# Altium schematic sheet 02-Power.SchDoc: ECE315 Power and Programming
size A; Date: 01/08/2018; ApprovedBy: JSK; CheckedBy: JSK; Author: JSK; CompanyName: University of Wisconsin; DrawnBy: JSK; Engineer: JSK; Organization: ECE 315; Address1: College of Engineering; Address2: 1415 Engineering Drive; Address3: Madison, WI 53706; Address4: ECE 315 Spring 2018; Revision: A; SheetNumber: 2; SheetTotal: 6; AssemblyNumber: ECE315-S18; ApprovedDate: 4/25/2017
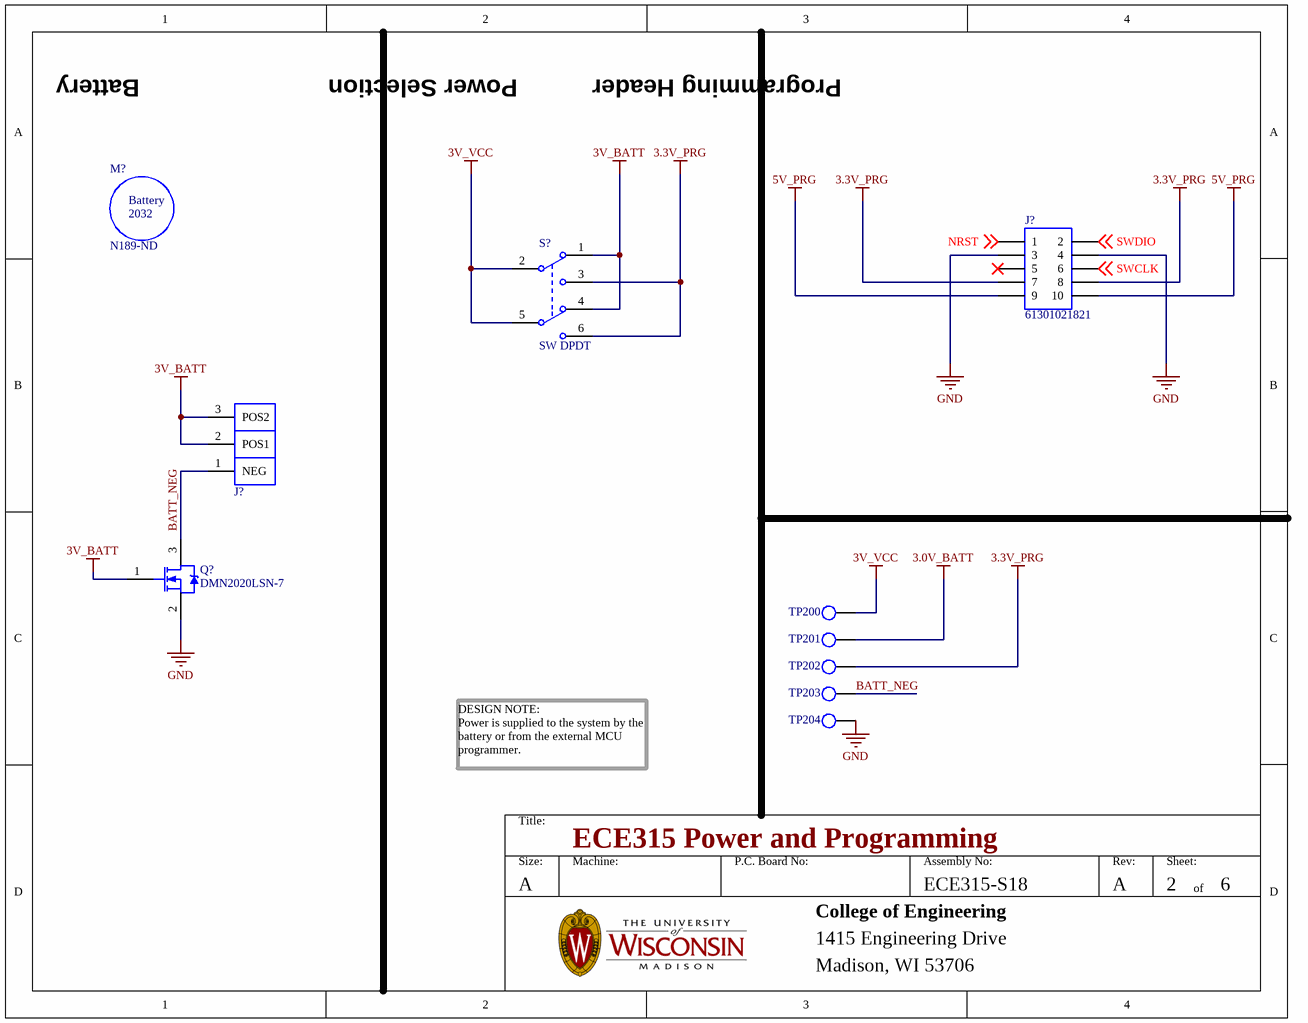
[diagram p0: 02-Power.SchDoc]

## Parts
(Parts that share a designator on the sheet are numbered #1, #2 ... from top to bottom, then left to right.)
J?#1  Manufacturer Part Number: 61301021821  [CONN_ST_PROGRAMMER]  (hidden comment: CONN_ST_PROGRAMMER)
J?#2  CONN_BAT_2032  [BATT_2032]  (value not drawn)
M?  Supplier Part Number 1: N189-ND  (hidden comment: BATTERY_2032)
Q?  Manufacturer Part Number: DMN2020LSN-7  [SOT23]  (hidden comment: IC_NMOS_DMN2020LSN)
S?  SW DPDT  [DPDT]
TP200  TP_1206  [TP-SMC-1206]  (value not drawn)
TP201  TP_1206  [TP-SMC-1206]  (value not drawn)
TP202  TP_1206  [TP-SMC-1206]  (value not drawn)
TP203  TP_1206  [TP-SMC-1206]  (value not drawn)
TP204  TP_1206  [TP-SMC-1206]  (value not drawn)

## Nets
3.0V_BATT: TP201.1
3.3V_PRG: J?#1.7 J?#1.8 S?.3(NO1) S?.6(NO2) TP202.1
3V_BATT: J?#2.2(POS1) J?#2.3(POS2) Q?.1 S?.1(NC1) S?.4(NC2)
3V_VCC: S?.2(COMMON1) S?.5(COMMON2) TP200.1
5V_PRG: J?#1.9 J?#1.10
GND: J?#1.3 J?#1.4 Q?.2 TP204.1
BATT_NEG: J?#2.1(NEG) Q?.3 TP203.1
NRST: J?#1.1 ; off-sheet NRST
SWCLK: J?#1.6 ; off-sheet SWCLK
SWDIO: J?#1.2 ; off-sheet SWDIO

Not connected (* = marked no-connect by the designer): J?#1 5*

## Notes on the sheet
- Battery
- Power Selection
- Programming Header
- DESIGN NOTE:
  Power is supplied to the system by the battery or from the external MCU programmer.
- Title:
- Size:
- A
- Machine:
- P.C. Board No:
- Assembly No:
- Rev:
- Sheet:
- of
- College of Engineering
- 1415 Engineering Drive
- Madison, WI 53706
- (in symbol BATTERY_2032) Battery; 2032

## Library data of the parts
J?#1 = CONN_ST_PROGRAMMER: CONN HEADER 2.54MM 10POS GOLD; Manufacturer: Wurth Electronics Inc.; Style: Board to Board; Number of Positions: 10; Number of Positions Loaded: All; Pitch - Mating: 0.100" (2.54mm); Contact Length - Post: 0.122" (3.10mm); Material Flammability Rating: UL94 V-0; Current Rating: 3A; Voltage Rating: 250VAC; Supplier 1: Digi-Key; RoHS: RoHS Compliant; Category: Connectors, Interconnects; Stock 1: 4086; Pricing 1: 1=0.74, 10=0.728, 50=0.672, 100=0.616, 320=0.56 (USD); Packaging: Tray; Part Status: Active; Connector Type: Header; Contact Type: Forked; Row Spacing - Mating: 0.100" (2.54mm); Mounting Type: Through Hole; Termination: Solder; Fastening Type: Push-Pull; Contact Finish - Mating: Gold; Contact Finish Thickness - Mating: -; Insulation Color: Black; Insulation Height: 0.331" (8.40mm); Operating Temperature: -40°C ~ 105°C; Contact Finish - Post: Gold; Mated Stacking Heights: -; Ingress Protection: -; Features: -; Applications: -; Insulation Material: Polybutylene Terephthalate (PBT); Contact Shape: Square; Contact Material: Copper Alloy; Contact Finish Thickness - Post: -; ComponentLink1URL: http://katalog.we-online.de/em/datasheet/6130xx21821.pdf; ComponentLink1Description: http://katalog.we-online.de/em/datasheet/6130xx21821.pdf; Supplier Part Number 1: 732-2861-ND
J?#2 = CONN_BAT_2032: HOLDER BATTERY 20MM COIN; Manufacturer: Linx; Manufacturer Part Number: BAT-HLD-001; Brand: Linx Technologies; Number of Batteries: 1 Battery; Number of Contacts: 1 Contact; Supplier 1: Digikey; Stock 1: 950; Pricing 1: 1=0.28, 25=0.2572, 100=0.233, 1000=0.2196 (USD); Product Category: Coin Cell Battery Holders; RoHS: Details; Product: Battery Holders; Battery Cell Size: 20 mm; Termination Style: SMD/SMT; Packaging: Bulk; Factory Pack Quantity: 1000; Type: 20 mm Battery Holder; ComponentLink1URL: https://datasheet.ciiva.com/4/bat-hld-001-4035.pdf; ComponentLink1Description: https://datasheet.ciiva.com/4/bat-hld-001-4035.pdf; ComponentLink2URL: https://datasheet.ciiva.com/4642/bat-hld-001-220194-4642567.pdf; ComponentLink2Description: https://datasheet.ciiva.com/4642/bat-hld-001-220194-4642567.pdf; ComponentLink3URL: https://datasheet.ciiva.com/16207/bat-hld-001-16207212.pdf; ComponentLink3Description: https://datasheet.ciiva.com/16207/bat-hld-001-16207212.pdf; Supplier Part Number 1: BAT-HLD-001-ND
M? = BATTERY_2032: Manufacturer: Energizer; Manufacturer Part Number: CR2032VP; MSDS Material Safety Datasheet: Lithium Manganese Dioxide(Coin/Button) PSDS; Battery Chemistry: Lithium; Battery Cell Size: Coin, 20.0mm; Voltage - Rated: 3V; Capacity: 240mAh; Discharge Rate: 190µA; Shipping Info: Due to possible restrictions, a change in ship method may be required.; Dynamic Catalog: CR (Coin) Series; For Use With: N533-ND / - CAP LIGHT 3-LED LITHIUM COIN; Associated Product: 952-1737-6-ND / - HOLDER BATT COIN CR2032/20MM / 952-1737-1-ND / - HOLDER BATT COIN CR2032/20MM / 952-1735-6-ND / - HOLDER BATT COIN CR2032/20MM / 952-1735-1-ND / - HOLDER BATT COIN CR2032/20MM / 952-1737-2-ND / - HOLDER BATT COIN CR2032/20MM / 952-1743-ND / - HOLDER BATT COIN CR2032/20MM / 952-1735-2-ND / - HOLDER BATT COIN CR2032/20MM / BH-20H-1TCT-ND / - HOLDER BATT COIN CELL 2032 SMD / 3082TRK-ND / - RETAINER COIN CELL 20MM SMD / 3072TRK-ND / - RETAINER COIN CELL 20MM SMD / More...; Other Names: 547-189 / 547-189-ND / N189; Supplier 1: Digikey; Stock 1: 563743; Pricing 1: 1=0.34, 10=0.31, 50=0.2758, 100=0.2414, 250=0.2207, 500=0.2069, 1000=0.1841, 2500=0.1729 (USD); Standard Package: 200; Category: Battery Products; Family: Batteries Non-Rechargeable (Primary); Series: CR2032; Size / Dimension: 0.79" Dia x 0.13" H (20.0mm x 3.2mm); Termination Style: Requires Holder; Weight: 0.1 oz (2.85g); ComponentLink1URL: https://datasheet.ciiva.com/6572/cr2032-6572607.pdf; ComponentLink1Description: https://datasheet.ciiva.com/6572/cr2032-6572607.pdf
Q? = IC_NMOS_DMN2020LSN: Manufacturer: Diodes; Rise Time: 12.49ns; Continuous Drain Current (ID): 6.9A; Gate to Source Voltage (Vgs): 12V; Turn-Off Delay Time: 35.89ns; Turn-On Delay Time: 11.67ns; Fall Time: 12.33ns; Input Capacitance: 1.149nF; Number of Elements: 1; Max Power Dissipation: 610mW; Rds On Max: 20mR; Drain to Source Resistance: 13mR; Drain to Source Voltage (Vdss): 20V; Threshold Voltage: 1V; Element Configuration: Single; Supplier 1: Digikey; Stock 1: 13099; Pricing 1: 1=0.52, 10=0.418, 100=0.2843, 500=0.2132, 1000=0.1599 (USD); Mount: Surface Mount; Case/Package: SC; Number of Pins: 3; Weight: 0.000282oz; Min Operating Temperature: -55°C; Max Operating Temperature: 150°C; Packaging: Tape and Reel; Package Quantity: 3000; Power Dissipation: 610mW; Number of Channels: 1; Length: 3.1mm; Height: 1.3mm; Width: 1.7mm; REACH SVHC: No SVHC; Lead Free: Lead Free; ComponentLink1URL: https://datasheet.ciiva.com/934/ds31946-934870.pdf; ComponentLink1Description: https://datasheet.ciiva.com/934/ds31946-934870.pdf; ComponentLink2URL: https://datasheet.ciiva.com/25625/0900766b8104e58b-25625153.pdf; ComponentLink2Description: https://datasheet.ciiva.com/25625/0900766b8104e58b-25625153.pdf; ComponentLink3URL: https://datasheet.ciiva.com/4444/ds31946-65244-4444482.pdf; ComponentLink3Description: https://datasheet.ciiva.com/4444/ds31946-65244-4444482.pdf; ComponentLink4URL: https://datasheet.ciiva.com/934/ds31946-934871.pdf; ComponentLink4Description: https://datasheet.ciiva.com/934/ds31946-934871.pdf; ComponentLink5URL: https://datasheet.ciiva.com/934/ds31946-934872.pdf; ComponentLink5Description: https://datasheet.ciiva.com/934/ds31946-934872.pdf; Supplier Part Number 1: DMN2020LSN-7DICT-ND
S? = SW DPDT: Switch; Manufacturer: ITT /  C&K Components; Manufacturer Part Number: JS202011SCQN; Actuator Color: Black; Maximum DC Voltage Rating: 6 V; Actuator Material: Nylon 4/6; Electrical Life: 15000 Cycles; Body Orientation: Straight; Maximum Contact Resistance: 70 mOhm; Actuator Style: Top Slide; Dielectric Strength: 500 VAC; Minimum Insulation Resistance: 100 MOhm; Contact Rating @ Voltage: 0.3@6VDC A; COO: US; Published: 24-Mar-1999; LatestRevisionDate: 29-May-2009; LatestRevisionNote: IPC-7351 Footprint Added.; PackageVersion: Mar-2001; PackageReference: SOT23-6; Publisher: Altium Limited; PackageDescription: 6-Pin SOT-23 Package 0.95 mm Pitch, 2.7 mm Lead Span; Code_JEITA: SC-74; Code_IPC: SOT26A-6; Supplier 1: C&K Components; Stock 1: 22661; Pricing 1: 1=0.46, 10=0.441, 25=0.4316, 50=0.3858, 100=0.3674, 250=0.3582, 500=0.3031 (USD); Part No: JS202011SCQN; RoHS: Yes; Supplier Standard Pack: 5,000; Type: Sub-Miniature; Maximum AC Voltage Rating: N/A; Family: JS; Contact Material: Copper Alloy; Seal Description: N/A; Pole Throw Configuration: DPDT; Mechanical Life: N/A; Packaging: Tape and Reel; Contact Plating: Silver; Switch Configuration: N/A; Housing Material: Nylon 4/6; Product Weight: N/A; Base Material: N/A; Mounting: Surface Mount,Gull Wing; Seal Location: N/A; Operating Temperature: -40 to 85 C; Dimension: 9 x 7.5 x 5.5 mm; HTS: 8536509050; ECCN: EAR99; ComponentLink1URL: https://datasheet.ciiva.com/23829/1707718-23829488.pdf; ComponentLink1Description: https://datasheet.ciiva.com/23829/1707718-23829488.pdf; ComponentLink2URL: https://datasheet.ciiva.com/2889/js-29aug13-2889127.pdf; ComponentLink2Description: https://datasheet.ciiva.com/2889/js-29aug13-2889127.pdf; ComponentLink3URL: https://datasheet.ciiva.com/2889/js-15sept15-2889128.pdf; ComponentLink3Description: https://datasheet.ciiva.com/2889/js-15sept15-2889128.pdf; ComponentLink4URL: https://datasheet.ciiva.com/2889/js-15sept15-2889129.pdf; ComponentLink4Description: https://datasheet.ciiva.com/2889/js-15sept15-2889129.pdf; ComponentLink5URL: https://datasheet.ciiva.com/22630/1707718-22630697.pdf; ComponentLink5Description: https://datasheet.ciiva.com/22630/1707718-22630697.pdf; ComponentLink6URL: https://datasheet.ciiva.com/8625/js-9dec14-8625470.pdf; ComponentLink6Description: https://datasheet.ciiva.com/8625/js-9dec14-8625470.pdf; Supplier Part Number 1: 401-2002-1-ND
TP200-TP204 = TP_1206: Test Point SMD 1206; Manufacturer: TE Connectivity (Tyco Electronics); Manufacturer Part Number: 1625854-1; Resistance Value: 0 Ohm; Temperature Coefficient: N/R; Supplier 1: Digi-Key; Supplier Part Number 1: A106143CT-ND; Stock 1: 31937; Pricing 1: 1=0.28, 10=0.261, 25=0.224, 50=0.1902, 100=0.1828, 250=0.1641, 500=0.1567, 1000=0.1306 (USD); Case Size: 1206; Dimension: 3.2 x 1.6 x 1.25mm; Family: RC; Mounting: Surface Mount; Operating Temperature: -55 to 125 C; Part No: 1625854-1; RoHS: Yes; Packaging: Tape and Reel; Termination Style: N/R; Terminal Pitch: N/R; Power Rating: N/R; Tolerance: N/R; ComponentLink1URL: https://datasheet.ciiva.com/6439/eng-ds-1773266-a-6439169.pdf; ComponentLink1Description: https://datasheet.ciiva.com/6439/eng-ds-1773266-a-6439169.pdf; ComponentLink2URL: https://datasheet.ciiva.com/30136/1773266-a-30136341.pdf; ComponentLink2Description: https://datasheet.ciiva.com/30136/1773266-a-30136341.pdf; ComponentLink3URL: https://datasheet.ciiva.com/6439/eng-ds-1773266-a-6439080.pdf; ComponentLink3Description: https://datasheet.ciiva.com/6439/eng-ds-1773266-a-6439080.pdf; ComponentLink4URL: https://datasheet.ciiva.com/6439/eng-ds-1773266-a-6439081.pdf; ComponentLink4Description: https://datasheet.ciiva.com/6439/eng-ds-1773266-a-6439081.pdf; ComponentLink5URL: https://datasheet.ciiva.com/6439/eng-ds-1773266-a-6439083.pdf; ComponentLink5Description: https://datasheet.ciiva.com/6439/eng-ds-1773266-a-6439083.pdf